# Altium schematic sheet +12_to_+3.3.SchDoc
size A; SheetNumber: 6; SheetTotal: 6
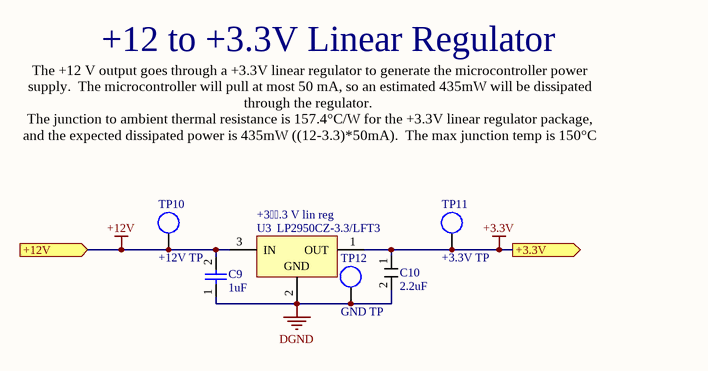
[diagram p0: +12_to_+3.3.SchDoc]

## Parts
C9  1uF  [CAPC2113X120X50LL20T30]
C10  2.2uF  [CAPMP3216X180N]
TP10  +12V TP  [PCBComponent_1]
TP11  +3.3V TP  [PCBComponent_1]
TP12  GND TP  [PCBComponent_1]
U3  LP2950CZ-3.3/LFT3  [LP0003A]

## Ports
+3.3V (out), +12V (in)

## Nets
+3.3V: C10.1(-) TP11.TP U3.1(OUT) ; port +3.3V
+12V: C9.2 TP10.TP U3.3(IN) ; port +12V
DGND: C9.1 C10.2(-) TP12.TP U3.2(GND)

## Notes on the sheet
- +12 to +3.3V Linear Regulator
- The +12 V output goes through a +3.3V linear regulator to generate the microcontroller power supply.  The microcontroller will pull at most 50 mA, so an estimated 435mW will be dissipated through the regulator.
  The junction to ambient thermal resistance is 157.4°C/W for the +3.3V linear regulator package, and the expected dissipated power is 435mW ((12-3.3)*50mA).  The max junction temp is 150°C so the dissipation will cause ~68°C, acceptable for the IC.
- (near U3) +3.3 V lin reg

## Library data of the parts
C9 = CMP-2007-04033-1: Manufacturer: AVX Interconnect / Elco; Part Number: TAJR105K020RNJ
C10 = CMP-001-00083-1: Cap Tant Solid 2.2uF 35V A CASE 10% (3.2 X 1.6 X 1.6mm) SMD 3216-18 7Ohm 125°C T/R; Pin 1 is +, Pin 2 is -
TP10-TP12 = Component_1
U3 = CMP-0062-00052-3: Series of Adjustable Micropower Voltage Regulators, 3-pin TO-92, Pb-Free; Manufacturer: Texas Instruments; CompType: LDO IC; PowerWise: N; PackageTopMarking: NSXYTT*2950*CZ3.3; Code_JEDEC: TO-226-AA; PinCount: 3; RoHS: Y; ComponentLink1Description: Datasheet URL; PackageDescription: TO-92, Molded, 3 Lead; ComponentLink1URL: http://www.ti.com/general/docs/lit/getliterature.tsp?genericPartNumber=LP2950-N&fileType=pdf; PackageReference: LP0003A